# EAGLE design flasher (EAGLE 7.6.0)
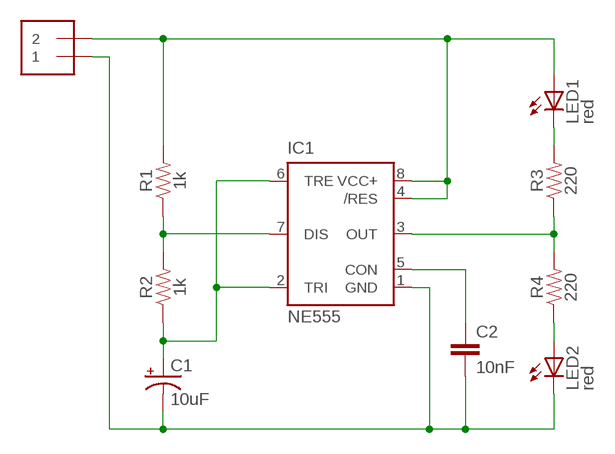
[diagram p0: schematic, sheet 1]

## Parts
C1  10uF  10UF-POLAR-RADIAL-2.5MM-25V-20%  [CPOL-RADIAL-2.5MM-5MM]
C2  10nF  10NF-0603-50V-10%  [0603]
IC1  NE555  [DIL-08]
J1  1X2-3.5MM  [1X2-3.5MM]
LED1  red  LED5MM  [LED5MM]
LED2  red  LED5MM  [LED5MM]
R1  1k  RESISTORAXIAL-0.3  [AXIAL-0.3]
R2  1k  RESISTORAXIAL-0.3  [AXIAL-0.3]
R3  220  RESISTORAXIAL-0.3  [AXIAL-0.3]
R4  220  RESISTORAXIAL-0.3  [AXIAL-0.3]

## Nets
GND: C1.2(-) C2.2 IC1.1(GND) J1.1 LED2.K(C)
N$1: IC1.3(OUT) R3.P$1 R4.P$2
N$2: C2.1 IC1.5(CON)
N$3: LED1.K(C) R3.P$2
N$5: IC1.7(DIS) R1.P$1 R2.P$2
N$6: C1.1(+) IC1.2(TRI) IC1.6(TRE) R2.P$1
N$7: LED2.A R4.P$1
VCC+: IC1.4(/RES) IC1.8(VCC+) J1.2 LED1.A R1.P$2

## Library data of the parts
C1 = SparkFun-Capacitors:10UF-POLAR: 10.0µF polarized capacitors A capacitor is a passive two-terminal electrical component used to store electrical energy temporarily in an electric field.; PROD_ID: CAP-08440
C2 = SparkFun-Capacitors:10NF: 0.01uF/10nF/10,000pF ceramic capacitors A capacitor is a passive two-terminal electrical component used to store electrical energy temporarily in an electric field. CAP-09321; PROD_ID: CAP-00867
IC1 = st-microelectronics:NE555: General purpose bipolar Timer; MF: Arrow Electronics; MPN: NE555N; OC_FARNELL: 1467742; OC_NEWARK: 89K1486
J1 = adafruit:1X2: 3.5mm Terminal block http://www.ladyada.net/library/pcb/eaglelibrary.html
LED1 LED2 = adafruit:LED: LED OSRAM: - CHIPLED LG R971, LG N971, LY N971, LG Q971, LY Q971, LO R971, LY R971 LH N974, LH R974 LS Q976, LO Q976, LY Q976 LO Q996 - Hyper CHIPLED LW Q18S LB Q993, LB Q99A, LB R99A - SideLED LS A670, LO A670, LY A670, LG A670, LP A670 LB A673, LV A673, LT A673, LW A673 LH A674 LY A675 LS A676, LA A676, LO A676, LY A676, LW A676 LS A679, LY A679, LG A679 - Hyper Micro SIDELED® LS Y876, LA Y876, LO Y876, LY Y876 LT Y87S - SmartLED LW L88C, LW L88S LB L89C, LB L89S, LG L890 LS L89K, LO L89K, LY L89K LS L896, LA L896, LO L896, LY L896 - TOPLED LS T670, LO T670, LY T670, LG T670, LP T670 LSG T670, LSP T670, LSY T670, LOP T670, LYG T670 LG T671, LOG T671, LSG T671 LB T673, LV T673, LT T673, LW T673 LH T674 LS T676, LA T676, LO T676, LY T676, LB T676, LH T676, LSB T676, LW T676 LB T67C, LV T67C, LT T67C, LS T67K, LO T67K, LY T67K, LW E67C LS E67B, LA E67B, LO E67B, LY E67B, LB E67C, LV E67C, LT E67C LW T67C LS T679, LY T679, LG T679 LS T770, LO T770, LY T770, LG T770, LP T770 LB T773, LV T773, LT T773, LW T773 LH T774 LS E675, LA E675, LY E675, LS T675 LS T776, LA T776, LO T776, LY T776, LB T776 LHGB T686 LT T68C, LB T68C - Hyper Mini TOPLED® LB M676 - Mini TOPLED Santana® LG M470 LS M47K, LO M47K, LY M47K Source: http://www.osram.convergy.de/
R1-R4 = SparkFun-Resistors:RESISTOR: Generic Resistor Package

## Board
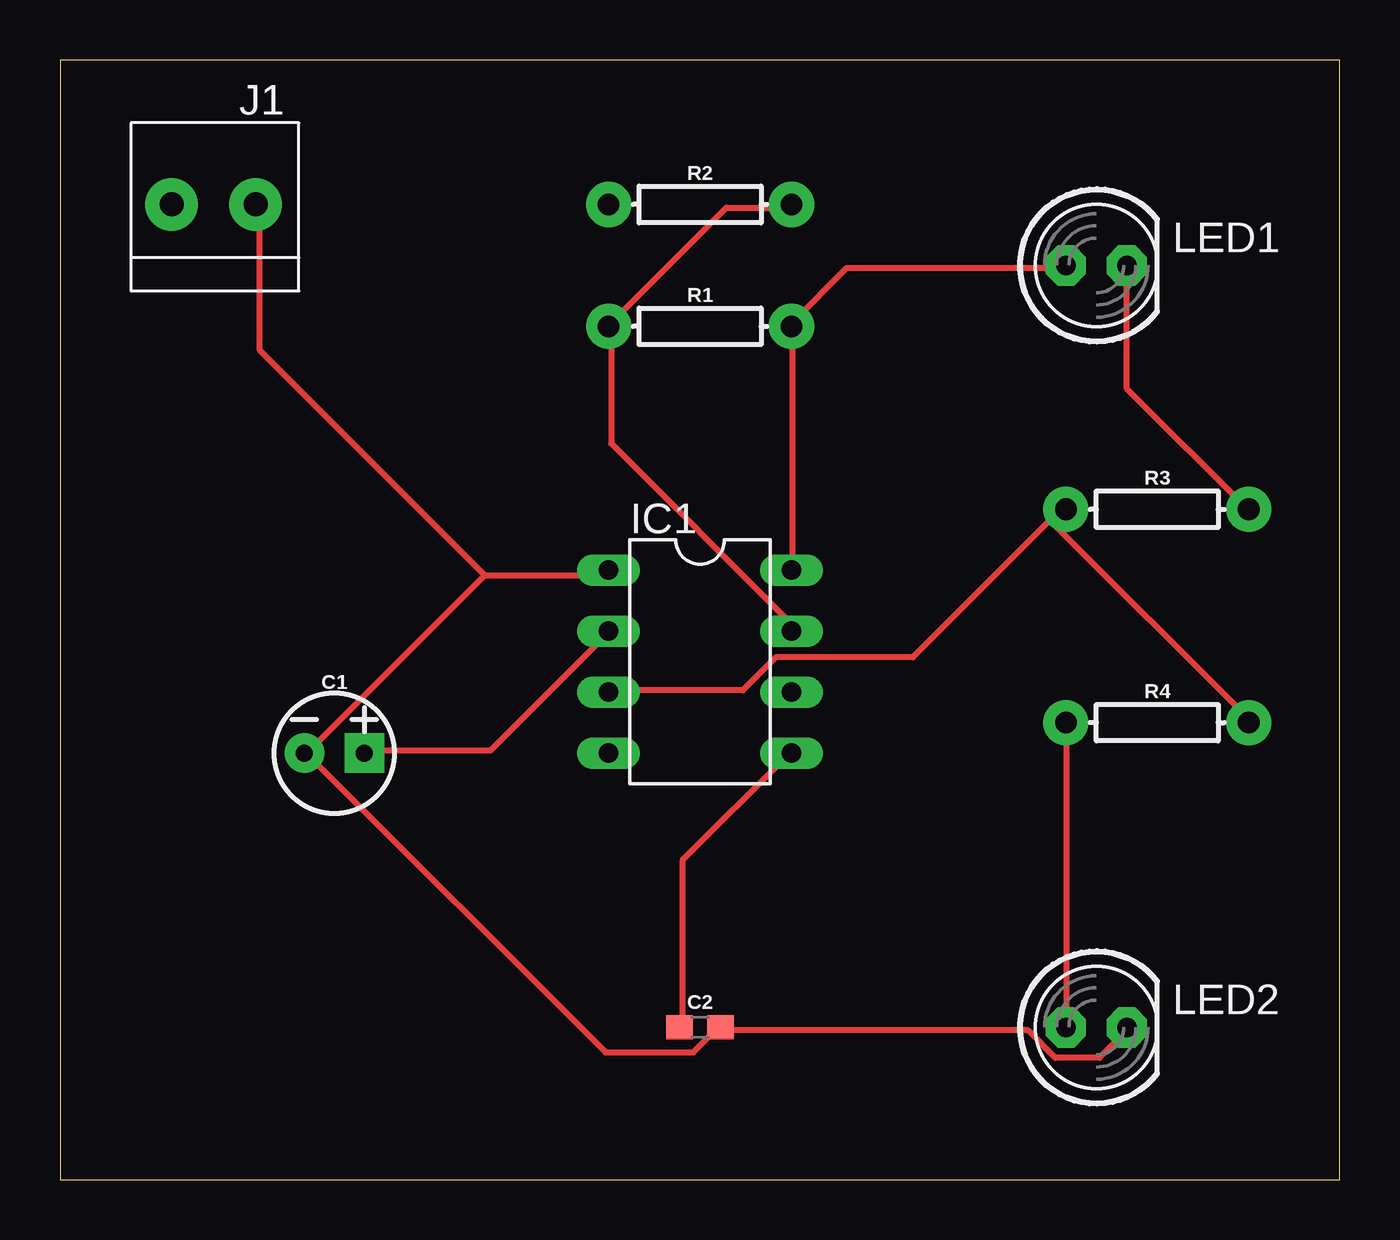
[diagram p1: board, top side]
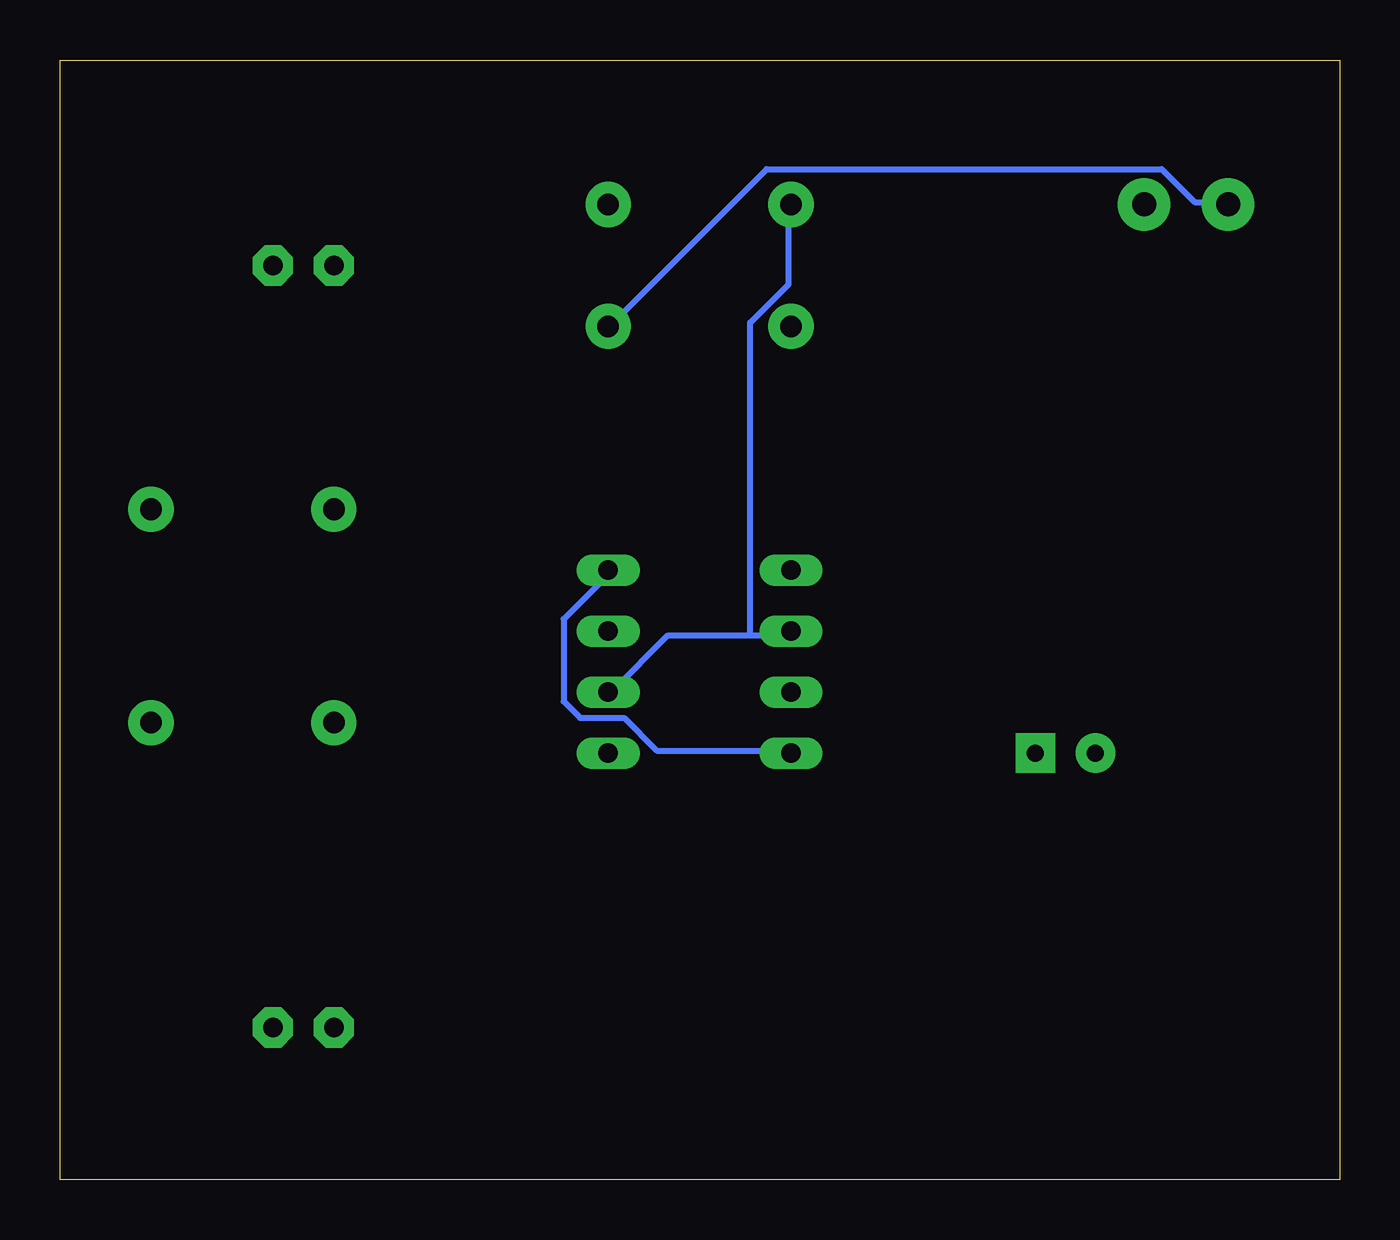
[diagram p2: board, bottom side, seen from below]

Size 53.32 x 46.66 mm. Coordinates in mm from the lower left corner, seen from the top.
Outline: 0,0 53.32,0 53.32,46.66 0,46.66 0,0
Copper layers (1*16): Top 0.035mm / dielectric 1.5mm / Bottom 0.035mm
Design rules "default": minimum track width 10mil, minimum drill 24mil, track to track 8mil, track to pad 8mil, pad to pad 8mil, via to via 8mil, smd to smd 8mil, copper to edge 40mil, drill to drill 8mil, minimum pad ring 10mil, minimum via ring 8mil, stop-mask expansion 4mil, vias tented up to drill 0mil, thermal gap 10mil

### Footprints (pad centres in the part's own frame; a part is rotated, then mirrored left to right if it is on the bottom)
CPOL-RADIAL-2.5MM-5MM = drill 0.7 pad 1.651 square: 1 1.25,0 | drill 0.7 pad 1.651: 2 -1.25,0
0603 = smd 1.1 x 1: 1 -0.85,0; 2 0.85,0
DIL-08 = drill 0.813 long: 1 -3.81,-3.81; 2 -1.27,-3.81; 3 1.27,-3.81; 4 3.81,-3.81; 5 3.81,3.81; 6 1.27,3.81; 7 -1.27,3.81; 8 -3.81,3.81
1X2-3.5MM = drill 1 pad 2.184: 1 1.8,0; 2 -1.7,0
LED5MM = drill 0.813 pad 1.676 octagon: A -1.27,0; K 1.27,0
AXIAL-0.3 = drill 0.9 pad 1.88: P$1 -3.81,0; P$2 3.81,0

### Placement (x,y rotation side)
C1  11.43,17.78 0 top
C2  26.67,6.35 0 top
IC1  26.67,21.59 270 top
J1  6.35,40.64 0 top
LED1  43.18,38.1 0 top
LED2  43.18,6.35 0 top
R1  26.67,35.56 0 top
R2  26.67,40.64 0 top
R3  45.72,27.94 0 top
R4  45.72,19.05 0 top

### Tracks (layer width: path | path; a pad name or v marks a point on that pad's centre or on a via)
GND
  Top 0.254: LED2.K 44.45,6.22 43.31,5.08 41.48,5.08 40.34,6.22 27.53,6.22 C2.2 27.31,6.22 26.39,5.31 22.73,5.31 10.39,17.65 C1.2 10.39,17.88 17.7,25.2 | 17.7,25.2 22.73,25.2 IC1.1 | 17.7,25.2 8.33,34.57 8.33,40.51 J1.1
N$1
  Top 0.254: 41.25,27.48 41.71,27.94 R3.P$1 41.25,27.48 | 41.25,27.48 35.53,21.77 29.82,21.77 28.45,20.4 22.96,20.4 IC1.3 | 41.25,27.48 49.48,19.25 R4.P$2
N$2
  Top 0.254: C2.1 25.93,6.45 25.93,13.31 30.28,17.65 IC1.5
N$3
  Top 0.254: LED1.K 44.45,32.97 49.48,27.94 R3.P$2
N$5
  Top 0.254: IC1.7 30.28,22.91 30.28,23.37 22.96,30.68 22.96,35.48 R1.P$1 22.96,35.71 27.76,40.51 30.28,40.51 R2.P$2
N$6
  Top 0.254: C1.1 12.9,17.88 17.93,17.88 22.73,22.68 IC1.2
  Bottom 0.254: 24.56,22.68 27.99,22.68 30.28,20.4 IC1.6 | 24.56,22.68 22.96,22.68 IC1.2 | 24.56,22.68 24.56,35.71 22.96,37.31 22.96,40.51 R2.P$1
N$7
  Top 0.254: LED2.A 41.94,6.45 41.94,19.02 R4.P$1
VCC+
  Top 0.254: LED1.A 41.71,38 32.79,38 30.5,35.71 R1.P$2 30.5,35.48 30.5,25.42 IC1.8
  Bottom 0.254: IC1.4 22.96,17.88 28.45,17.88 29.82,19.25 31.65,19.25 32.33,19.94 32.33,23.37 30.5,25.2 IC1.8 | J1.2 4.67,40.74 6.05,40.74 7.42,42.11 23.88,42.11 30.28,35.71 R1.P$2